# Altium schematic sheet (1)shematic block.SchDoc
size A; SheetNumber: 1; SheetTotal: 1
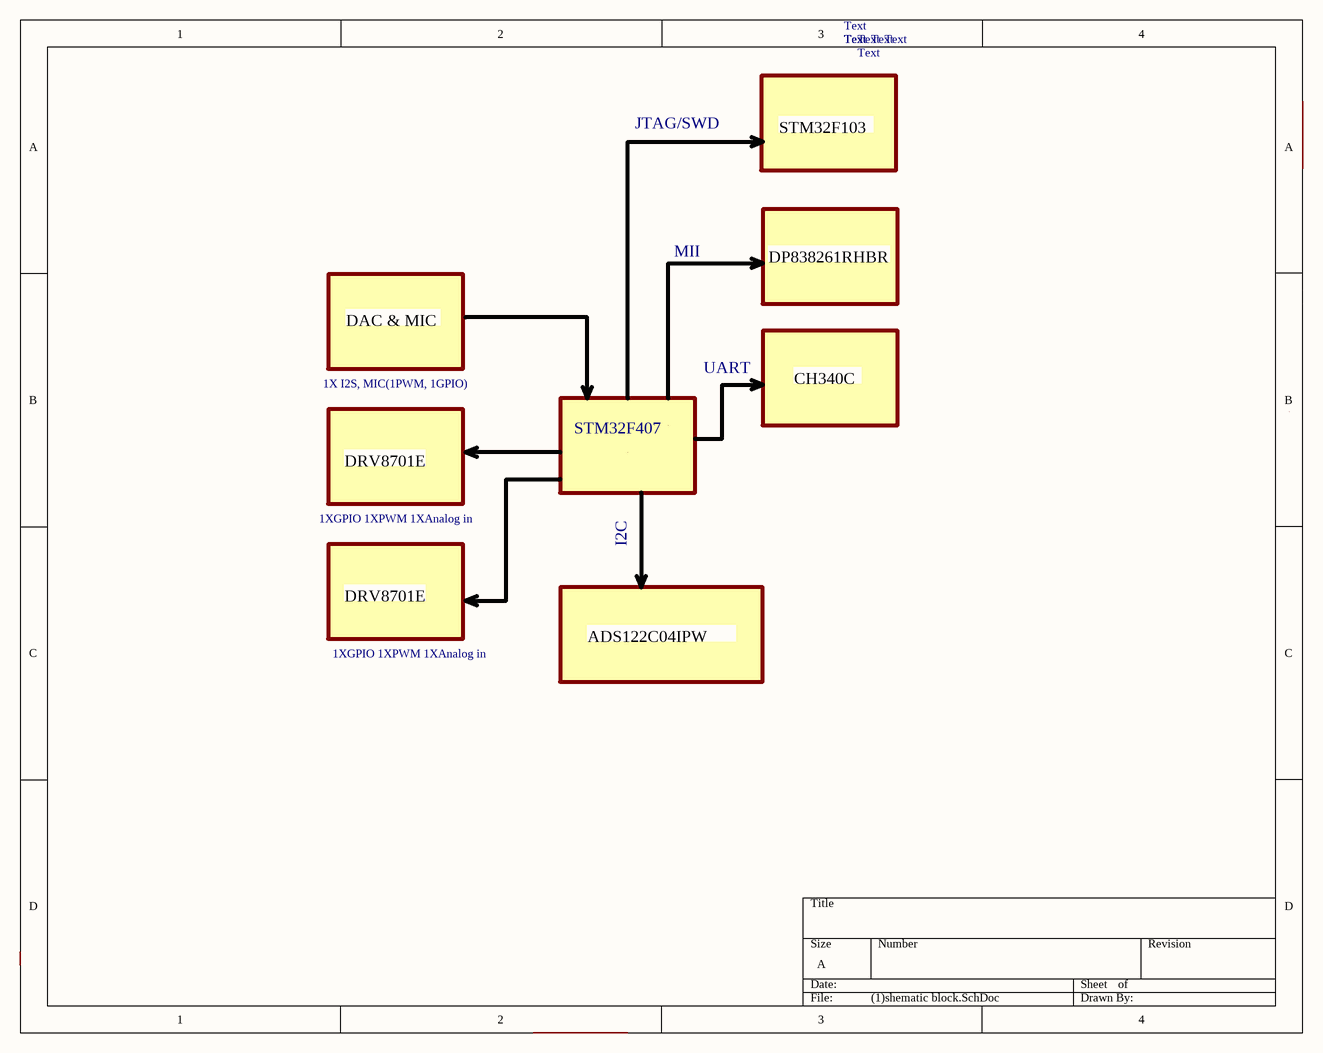
[diagram p0: (1)shematic block.SchDoc]

## Notes on the sheet
- Text
- JTAG/SWD
- STM32F103
- MII
- DP838261RHBR
- 1X I2S, MIC(1PWM, 1GPIO)
- DAC & MIC
- UART
- CH340C
- STM32F407
- 1XGPIO 1XPWM 1XAnalog in
- DRV8701E
- I2C
- ADS122C04IPW